# EAGLE design miniE_arduino_shield_v1-3 (EAGLE 6.1)
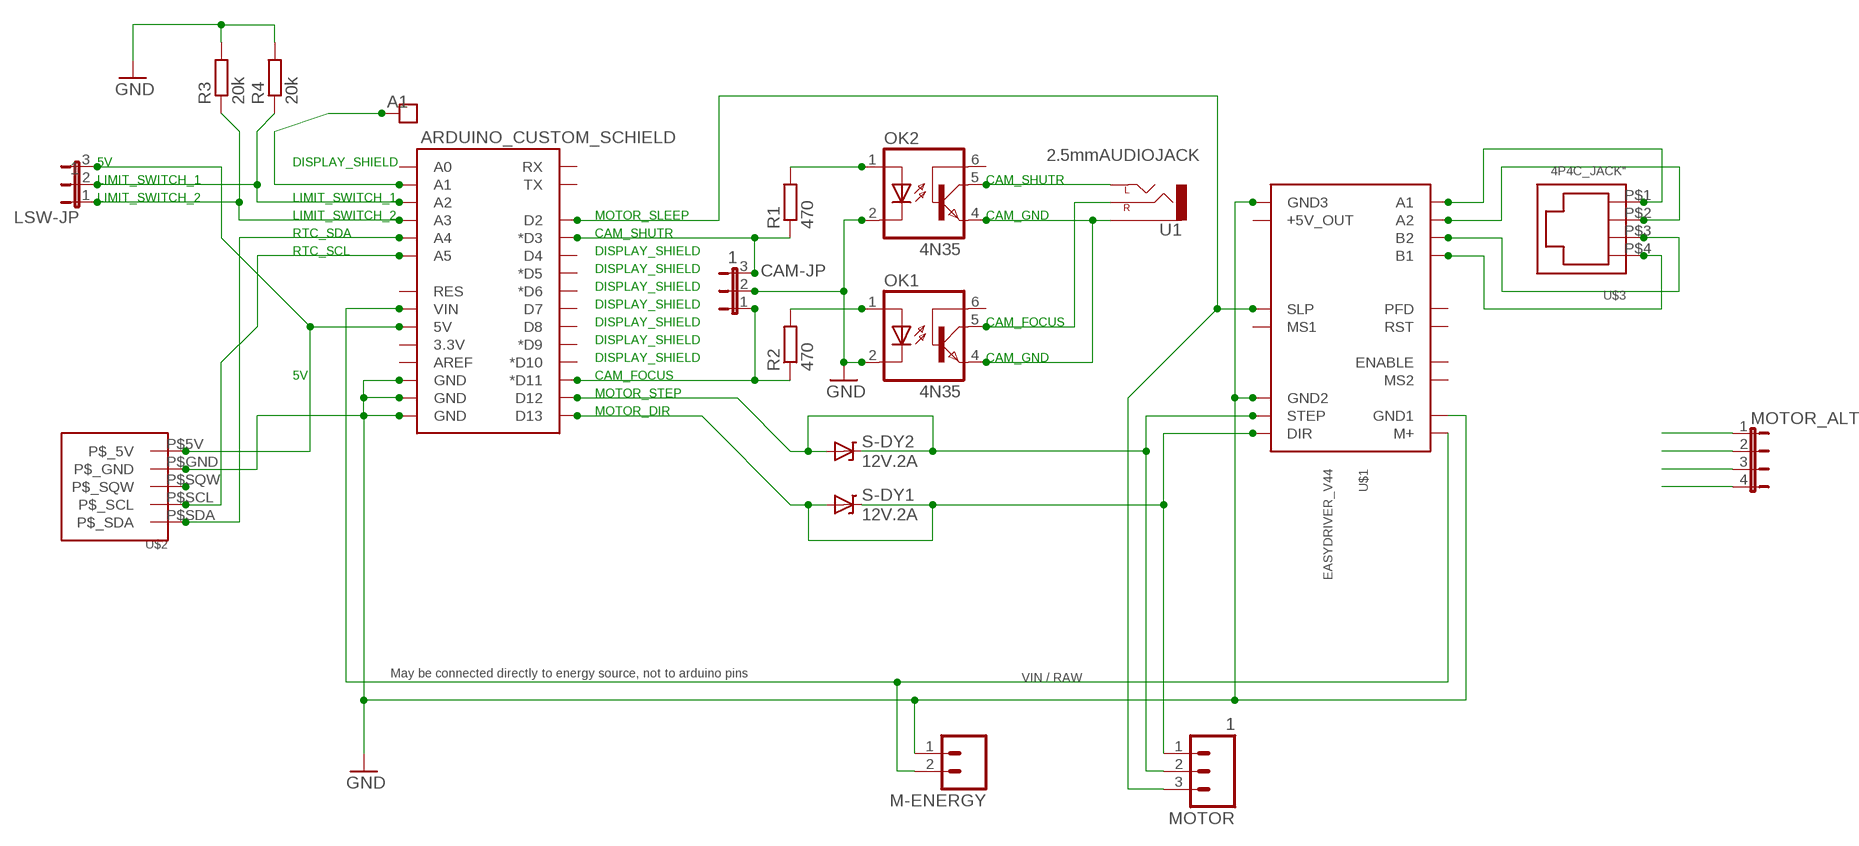
[diagram p0: schematic, sheet 1]

## Parts
ARDUINO_CUSTOM_SCHIELD  ARDUINO_SHIELDNOLABELS  [DUEMILANOVE_SHIELD_NOLABELS]
CAM-JP  1  JP2E  [JP2]
LSW-JP  1  JP2E  [JP2]
M-ENERGY  MOLEX_02  M02PTH  [1X02]
MOTOR  1  M03PTH  [1X03]
MOTOR_ALT  JP4E  [JP4]
OK1  4N35  [DIL06]
OK2  4N35  [DIL06]
R1  470  R-EU_0207/10  [0207/10]
R2  470  R-EU_0207/10  [0207/10]
R3  20k  R-EU_0207/10  [0207/10]
R4  20k  R-EU_0207/10  [0207/10]
S-DY1  12V.2A  DIODE-ZENERPTH  [DIODE-ZENER]
S-DY2  12V.2A  DIODE-ZENERPTH  [DIODE-ZENER]
U1  2.5mmAUDIOJACK  AUDIO-JACK2.5MM  [STEREOJACK2.5MM_STEREOJACK2.5MM]
U$1  EASYDRIVER_V44  [EASYDRIVER_V44]
U$2  SPARKFUN_RTC_MODULE-OPTIONAL  [SPARKFUN_RTC_MODULE_OPTIONAL]
U$3  4P4C_JACK"  [4P4C_JACK-ASS-2004-3-4-LP-N-R]
U$4  JUMPER_1X1  [JUMPER_1X1]

## Nets
+5V: ARDUINO_CUSTOM_SCHIELD.5V LSW-JP.3 U$2.P$5V(P$_5V)
A1: MOTOR_ALT.1 U$1.A1 U$3.P$1
A2: MOTOR_ALT.2 U$1.A2 U$3.P$2
B1: MOTOR_ALT.4 U$1.B1 U$3.P$4
B2: MOTOR_ALT.3 U$1.B2 U$3.P$3
CAM_FOCUS: OK1.5(COL) U1.RING1(RIGHT) U1.RING2(RIGHT)
CAM_GND: OK1.4(EMI) OK2.4(EMI) U1.SLEEVE
CAM_SHUTTER: OK2.5(COL) U1.TIP(LEFT)
GND: ARDUINO_CUSTOM_SCHIELD.GND@0(GND) ARDUINO_CUSTOM_SCHIELD.GND@1(GND) ARDUINO_CUSTOM_SCHIELD.GND@2(GND) CAM-JP.2 M-ENERGY.1 OK1.2(C) OK2.2(C) R3.2 R4.2 U$1.GND1 U$1.GND2 U$1.GND3 U$2.P$GND(P$_GND)
N$1: ARDUINO_CUSTOM_SCHIELD.D12 MOTOR.2 S-DY2.P$1(C) S-DY2.P$2(A) U$1.STEP
N$2: ARDUINO_CUSTOM_SCHIELD.D11(*D11) CAM-JP.1 R2.1
N$3: ARDUINO_CUSTOM_SCHIELD.D3(*D3) CAM-JP.3 R1.1
N$4: U$2.P$SQW(P$_SQW)
N$8: ARDUINO_CUSTOM_SCHIELD.D13 MOTOR.1 S-DY1.P$1(C) S-DY1.P$2(A) U$1.DIR
N$10: ARDUINO_CUSTOM_SCHIELD.D2 MOTOR.3 U$1.SLEEP(SLP)
N$11: OK2.1(A) R1.2
N$13: OK1.1(A) R2.2
N$16: ARDUINO_CUSTOM_SCHIELD.A2 LSW-JP.2 R4.1
N$17: ARDUINO_CUSTOM_SCHIELD.A3 LSW-JP.1 R3.1
N$18: ARDUINO_CUSTOM_SCHIELD.A4 U$2.P$SDA(P$_SDA)
N$19: ARDUINO_CUSTOM_SCHIELD.A5 U$2.P$SCL(P$_SCL)
N$24: ARDUINO_CUSTOM_SCHIELD.A1 U$4.P$1
VIN: ARDUINO_CUSTOM_SCHIELD.VIN M-ENERGY.2 U$1.M+
Unconnected: ARDUINO_CUSTOM_SCHIELD.3.3V ARDUINO_CUSTOM_SCHIELD.A0 ARDUINO_CUSTOM_SCHIELD.AREF ARDUINO_CUSTOM_SCHIELD.D4 ARDUINO_CUSTOM_SCHIELD.D5(*D5) ARDUINO_CUSTOM_SCHIELD.D6(*D6) ARDUINO_CUSTOM_SCHIELD.D7 ARDUINO_CUSTOM_SCHIELD.D8 ARDUINO_CUSTOM_SCHIELD.D9(*D9) ARDUINO_CUSTOM_SCHIELD.D10(*D10) ARDUINO_CUSTOM_SCHIELD.RES ARDUINO_CUSTOM_SCHIELD.RX ARDUINO_CUSTOM_SCHIELD.TX OK1.6(BAS) OK2.6(BAS) U$1.ENABLE U$1.MS1 U$1.MS2 U$1.P$11(+5V_OUT) U$1.PFD U$1.RST

## Notes on the sheet
- A1
- 5V | DISPLAY_SHIELD
- LIMIT_SWITCH_1 | CAM_SHUTR
- LIMIT_SWITCH_2 | LIMIT_SWITCH_1
- LIMIT_SWITCH_2 | MOTOR_SLEEP | CAM_GND
- RTC_SDA | CAM_SHUTR
- RTC_SCL | DISPLAY_SHIELD
- DISPLAY_SHIELD
- DISPLAY_SHIELD
- DISPLAY_SHIELD
- DISPLAY_SHIELD | CAM_FOCUS
- DISPLAY_SHIELD
- DISPLAY_SHIELD | CAM_GND
- 5V | CAM_FOCUS
- MOTOR_STEP
- MOTOR_DIR
- May be connected directly to energy source, not to arduino pins
- VIN / RAW

## Library data of the parts
ARDUINO_CUSTOM_SCHIELD = SparkFun:ARDUINO_SHIELD
CAM-JP LSW-JP = jumper:JP2E: JUMPER
M-ENERGY = SparkFun:M02: Header 2 Standard 2-pin 0.1" header. Use with straight break away headers (SKU : PRT-00116), right angle break away headers (PRT-00553), swiss pins (PRT-00743), machine pins (PRT-00117), and female headers (PRT-00115). Molex polarized connector foot print use with SKU : PRT-08233 with associated crimp pins and housings.
MOTOR = SparkFun:M03: Header 3 Standard 3-pin 0.1" header. Use with straight break away headers (SKU : PRT-00116), right angle break away headers (PRT-00553), swiss pins (PRT-00743), machine pins (PRT-00117), and female headers (PRT-00115). Molex polarized connector foot print use with SKU : PRT-08232 with associated crimp pins and housings.
MOTOR_ALT = jumper:JP4E: JUMPER
OK1 OK2 = optocoupler:4N35: MOTOROLA OPTO COUPLER; MF: FAIRCHILD SEMICONDUCTOR; MPN: 4N35; OC_FARNELL: 1328375; OC_NEWARK: 72K9946
R1-R4 = resistor:R-EU_: RESISTOR, European symbol
S-DY1 S-DY2 = SparkFun:DIODE-ZENER: Zener Diode Production Part - 8199 3.4V Zener Voltage
U1 = SparkFun:AUDIO-JACK: 3.5mm Audio Jack Simple 3.5mm common PCB mount audio jack. SKU: PRT-08032
U$1 = EasyDriver:EASYDRIVER_V44: EasyDriver version 4.4 - http://www.schmalzhaus.com/EasyDriver
U$2 = Personal:SPARKFUN_RTC_MODULE
U$3 = Airic Lenz:4P4C_JACK
U$4 = Airic Lenz:JUMPER_1X1

## Board
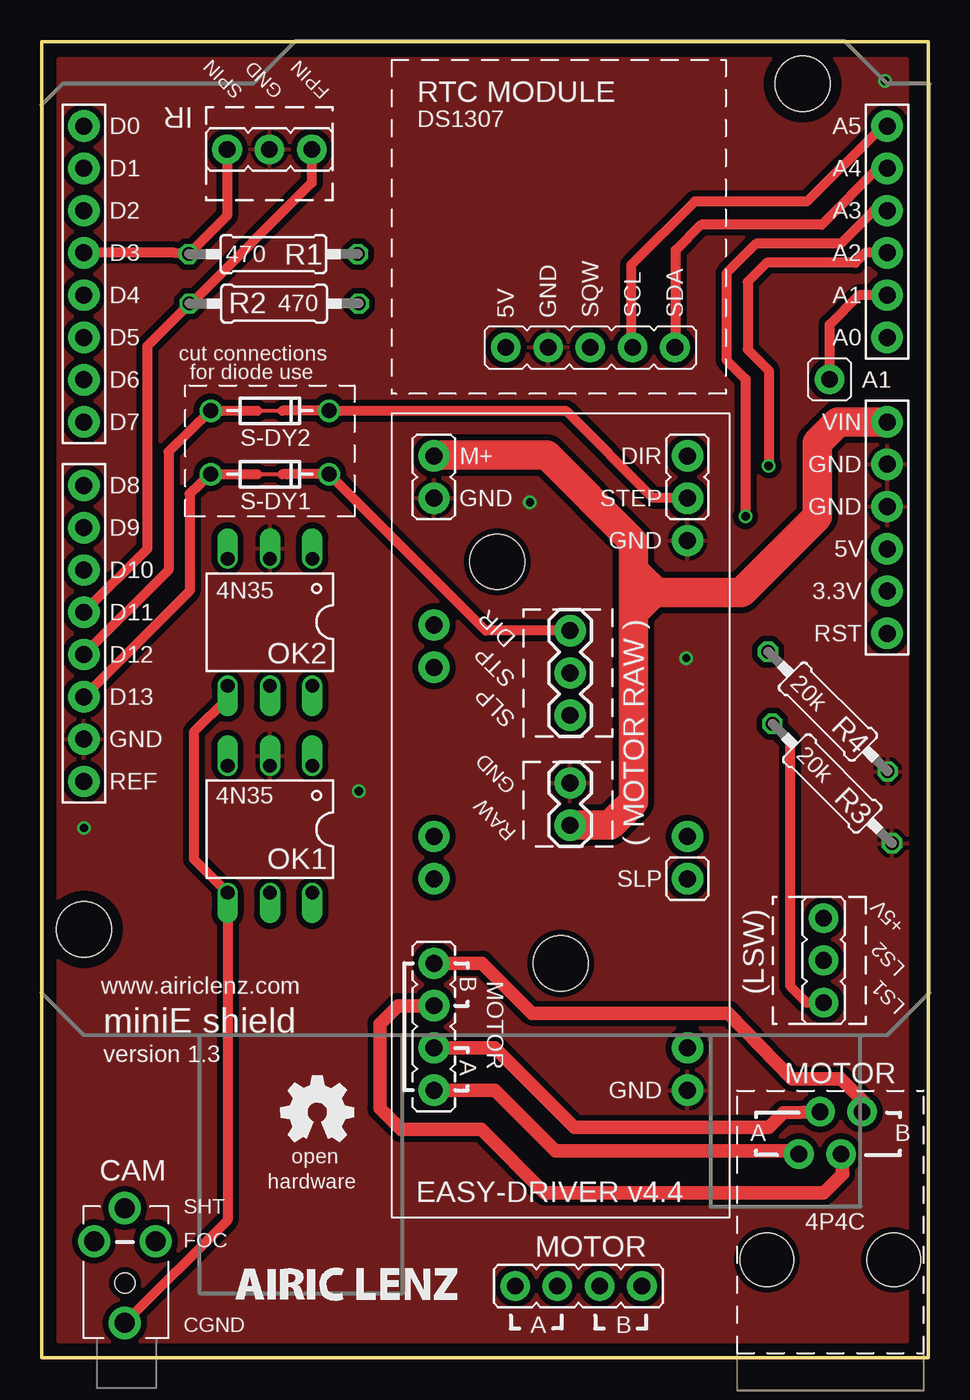
[diagram p1: board, top side]
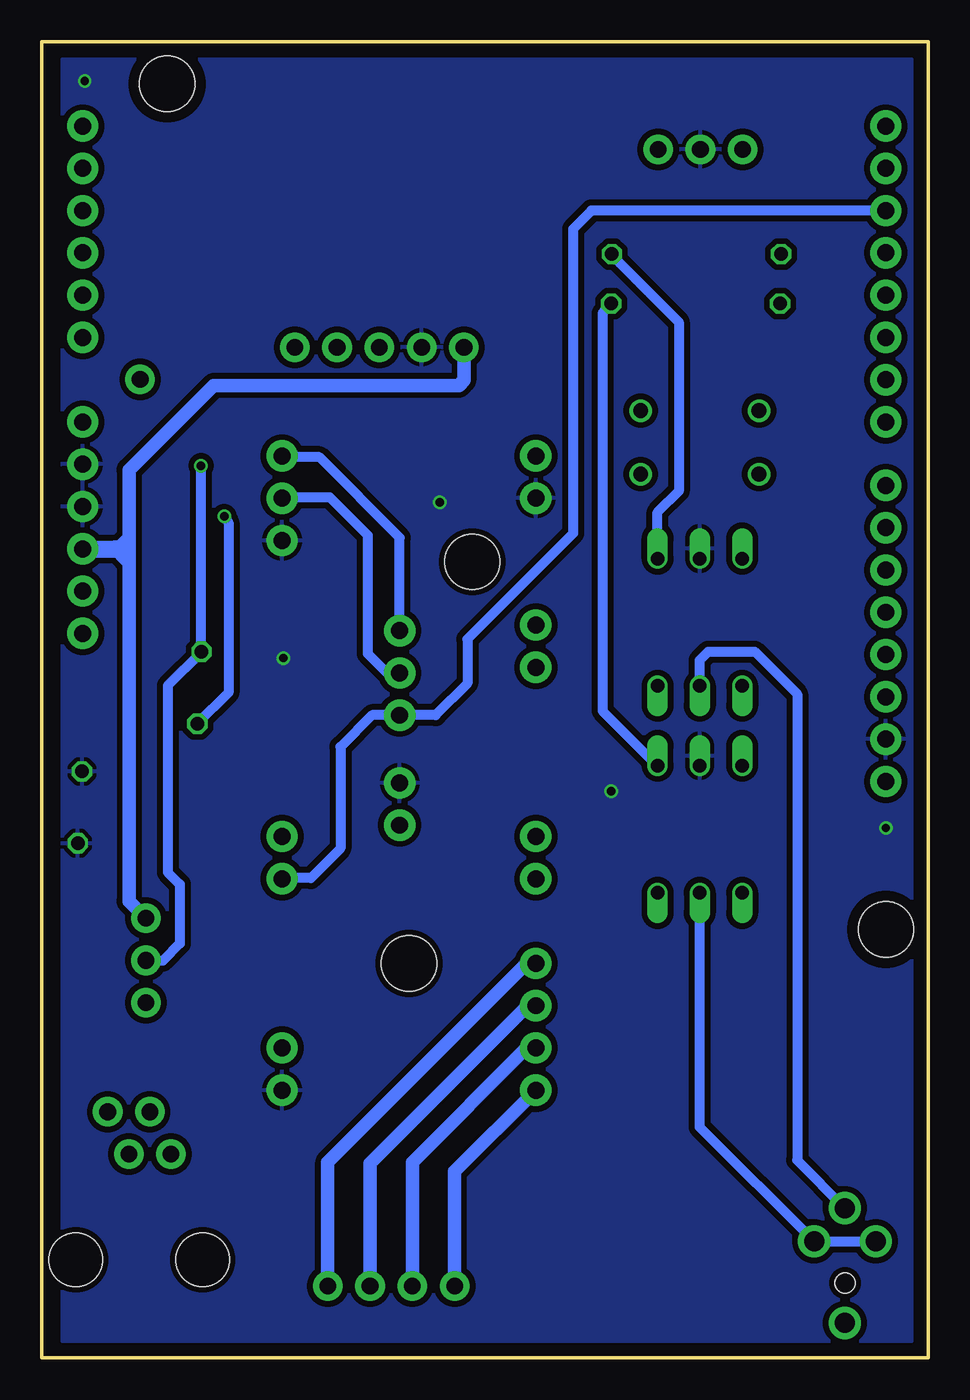
[diagram p2: board, bottom side, seen from below]

Size 53.26 x 79.07 mm. Coordinates in mm from the lower left corner, seen from the top.
Outline: 0,0 53.26,0 53.26,79.07 0,79.07 0,0
Copper layers (1*2*15*16): Top 0.035mm / dielectric 0.2mm / layer 2 0.0175mm / dielectric 1.1mm / layer 15 0.0175mm / dielectric 0.2mm / Bottom 0.035mm
Design rules "SeeedStudio_DRU_no_angle_20130527": minimum track width 6mil, minimum drill 12mil, track to track 6mil, track to pad 6mil, pad to pad 6mil, via to via 6mil, smd to smd 0mil, copper to edge 10mil, drill to drill 10mil, minimum pad ring 6mil, minimum via ring 6mil, stop-mask expansion 2mil, vias tented up to drill 25mil, thermal gap 10mil

### Footprints (pad centres in the part's own frame; a part is rotated, then mirrored left to right if it is on the bottom)
DUEMILANOVE_SHIELD_NOLABELS = drill 1.016 pad 1.88: 3.3V 50.8,26.67; 5V 50.8,29.21; A0 50.8,41.91; A1 50.8,44.45; A2 50.8,46.99; A3 50.8,49.53; A4 50.8,52.07; A5 50.8,54.61; AREF 2.54,15.24; D2 2.54,49.53; D3 2.54,46.99; D4 2.54,44.45; D5 2.54,41.91; D6 2.54,39.37; D7 2.54,36.83; D8 2.54,33.02; D9 2.54,30.48; D10 2.54,27.94; D11 2.54,25.4; D12 2.54,22.86; D13 2.54,20.32; GND@0 50.8,31.75; GND@1 50.8,34.29; GND@2 2.54,17.78; RES 50.8,24.13; RX 2.54,54.61; TX 2.54,52.07; VIN 50.8,36.83 | hole 3.302: 45.72,57.15; 2.54,6.35
JP2 = drill 1 pad 1.778: 1 -2.54,0; 2 0,0; 3 2.54,0
1X02 = drill 1.016 pad 1.88: 1 0,0; 2 2.54,0
1X03 = drill 1.016 pad 1.88: 1 0,0; 2 2.54,0; 3 5.08,0
JP4 = drill 1 pad 1.778: 1 -3.81,0; 2 -1.27,0; 3 1.27,0; 4 3.81,0
DIL06 = drill 0.813 offset: 1 -2.54,-3.81; 2 0,-3.81; 3 2.54,-3.81; 4 2.54,3.81; 5 0,3.81; 6 -2.54,3.81
0207/10 = drill 0.813 octagon: 1 -5.08,0; 2 5.08,0
DIODE-ZENER = drill 0.9: P$1 -3.556,0; P$2 3.556,0
STEREOJACK2.5MM_STEREOJACK2.5MM = drill 1.2 pad 1.93: RING1 2.5,1.85; RING2 2.5,-1.85; SLEEVE -2.4,0; TIP 4.5,0 | hole 1.2: 0,0
EASYDRIVER_V44 = drill 1.016 pad 1.88: A1 -16.51,7.62; A2 -13.97,7.62; B1 -8.89,7.62; B2 -11.43,7.62; DIR 21.59,-7.62; ENABLE 8.89,7.62; GND1 19.05,7.62; GND2 16.51,-7.62; GND3 -16.51,-7.62; M+ 21.59,7.62; MS1 -1.27,-7.62; MS2 11.43,7.62; P$11 -13.97,-7.62; PFD -3.81,7.62; RST -1.27,7.62; SLEEP -3.81,-7.62; STEP 19.05,-7.62 | hole 3.302: 15.24,3.81; -8.89,0
SPARKFUN_RTC_MODULE_OPTIONAL = drill 1 pad 1.778: P$5V -3.302,-8.128; P$GND -0.762,-8.128; P$SCL 4.318,-8.128; P$SDA 6.858,-8.128; P$SQW 1.778,-8.128
4P4C_JACK-ASS-2004-3-4-LP-N-R = drill 1 pad 1.778: P$1 -1.9,6.35; P$2 -0.63,8.89; P$3 0.63,6.35; P$4 1.9,8.89 | hole 3.2: -3.81,0; 3.81,0
JUMPER_1X1 = drill 1 pad 1.778: P$1 0,0

### Placement (x,y rotation side)
ARDUINO_CUSTOM_SCHIELD  0,19.39 0 top
CAM-JP  13.69,72.59 180 top
LSW-JP  46.99,23.88 90 top
M-ENERGY  31.75,34.54 270 top
MOTOR  31.75,43.69 270 top
MOTOR_ALT  32.26,4.32 0 top
OK1  13.72,31.75 180 top
OK2  13.72,44.2 180 top
R1  13.92,66.31 0 top
R2  13.97,63.33 0 top
R3  47.5,34.5 315 top
R4  47.24,38.82 315 top
S-DY1  13.72,53.09 180 top
S-DY2  13.72,56.9 180 top
U1  5,4.5 90 top
U$1  31.19,32.59 90 top
U$2  31.19,68.83 0 top
U$3  47.4,5.89 0 top
U$4  47.35,58.78 0 top

### Tracks (layer width: path | path; a pad name or v marks a point on that pad's centre or on a via)
+5V
  Bottom 0.813: 48.85,48.6 48.77,48.51 | 48.77,48.51 48.26,48.01 | 48.26,48.01 48.01,47.75 | 48.01,47.75 48.01,27.43 LSW-JP.3 | U$2.P$5V 27.89,58.73 28.19,58.42 42.93,58.42 48.01,53.34 48.01,49.28 | 48.01,49.28 48.01,48.26 | 48.01,48.26 48.26,48.01 | 48.77,48.51 48.01,49.28 | 48.01,48.26 48.01,47.75
  Bottom 1.016: ARDUINO_CUSTOM_SCHIELD.5V 48.85,48.6
A1
  Top 0.813: U$1.A1 27.23,16.08 30.86,12.45 45.34,12.45 45.59,12.19 U$3.P$1
  Bottom 0.813: MOTOR_ALT.1 28.45,11.2 U$1.A1
A2
  Top 0.813: U$1.A2 27.23,18.62 32,13.84 43.69,13.84 44.58,14.73 U$3.P$2
  Bottom 0.813: MOTOR_ALT.2 30.99,11.76 24.13,18.62 U$1.A2
B1
  Top 0.813: U$1.B1 26.47,23.7 29.46,20.7 41.27,20.7 45.09,16.76 48.01,16.76 49.4,15.37 49.4,14.73 U$3.P$4
  Bottom 0.813: MOTOR_ALT.4 36.07,11.76 24.13,23.7 U$1.B1
B2
  Top 0.813: U$1.B2 21.41,21.16 20.32,20.07 20.32,14.99 21.59,13.72 26.42,13.72 30.23,9.91 46.99,9.91 48.13,11.05 U$3.P$3
  Bottom 0.813: MOTOR_ALT.3 33.53,11.68 24.13,21.08 23.65,21.08 U$1.B2
CAM_FOCUS
  Bottom 0.61: OK1.5 13.72,13.86 U1.RING2 U1.RING1
CAM_GND
  Top 0.61: OK2.4 11.18,39.62 9.14,37.59 9.14,29.97 OK1.4 11.18,8.27 U1.SLEEVE
CAM_SHUTTER
  Bottom 0.61: OK2.5 13.72,41.91 13.21,42.42 10.41,42.42 7.87,39.88 7.87,11.87 U1.TIP
GND  (via drill 0.5)
  other vias: 2.54,31.84 50.67,76.71 29.34,51.39 38.73,42.04 19.05,34.04
  pour Top (isolate 0.35): 1,1 52,1 52,78 1,78 1,77
  pour Bottom (isolate 0.35): 1,1 52,1 52,78 1,78
N$1
  Top 0.254: 12.95,56.9 14.48,56.9
  Top 0.61: 2.63,42.16 ARDUINO_CUSTOM_SCHIELD.D12 7.62,47.33 7.62,54.44 S-DY2.P$2 12.95,56.9 | U$1.STEP 38.76,51.69 36.7,51.69 31.5,56.9 S-DY2.P$1 14.48,56.9
  Bottom 0.61: MOTOR.2 32.51,41.15 33.66,42.29 33.66,49.4 35.94,51.69 38.76,51.69 U$1.STEP
N$2
  Top 0.61: 2.58,44.83 ARDUINO_CUSTOM_SCHIELD.D11 6.35,48.6 6.35,60.79 R2.1 8.98,63.33 16.23,70.58 CAM-JP.1
N$3
  Top 0.61: ARDUINO_CUSTOM_SCHIELD.D3 8,66.38 R1.1 11.15,68.61 CAM-JP.3
N$8
  Top 0.254: 12.95,53.09 14.73,53.09
  Top 0.61: MOTOR.1 28.96,43.69 26.67,43.69 S-DY1.P$1 14.73,53.09 14.48,53.09 | ARDUINO_CUSTOM_SCHIELD.D13 8.89,46.06 8.89,51.9 S-DY1.P$2 12.95,53.09
  Bottom 0.61: U$1.DIR 38.73,54.1 36.58,54.1 31.75,49.28 MOTOR.1
N$10
  Bottom 0.61: U$1.SLEEP 38.76,28.83 37.08,28.83 35.31,30.61 35.31,36.7 33.4,38.6 MOTOR.3 29.59,38.61 27.69,40.51 27.69,43.18 21.34,49.53 21.34,67.82 20.23,68.92 ARDUINO_CUSTOM_SCHIELD.D2
N$11
  Bottom 0.61: R1.2 19.06,66.31 14.99,62.23 14.99,52.07 16.26,50.8 OK2.1
N$13
  Bottom 0.61: OK1.1 19.56,38.86 19.56,62.74 R2.2
N$16  (via drill 0.5)
  Top 0.61: ARDUINO_CUSTOM_SCHIELD.A2 49.49,66.38 48.9,65.79 43.56,65.79 42.42,64.64 42.42,60.58 43.69,59.31 v43.69,53.59
  Bottom 0.61: v43.69,53.59 43.69,42.38 R4.1 45.68,40.38 45.68,29.17 44.96,28.45 44.96,24.89 45.97,23.88 LSW-JP.2
N$17  (via drill 0.5)
  Top 0.61: ARDUINO_CUSTOM_SCHIELD.A3 50,68.92 48.01,66.93 42.93,66.93 41.15,65.15 41.15,59.94 42.29,58.8 v42.29,50.55 | R3.1 44.96,37.04 44.96,22.35 45.97,21.34 LSW-JP.1
  Bottom 0.61: v42.29,50.55 42.04,50.16 42.04,39.96 R3.1
N$18
  Top 0.61: ARDUINO_CUSTOM_SCHIELD.A4 50.25,71.46 46.86,68.07 39.62,68.07 38.1,66.55 38.1,60.76 U$2.P$SDA
N$19
  Top 0.61: ARDUINO_CUSTOM_SCHIELD.A5 50.33,73.79 45.97,69.47 39.24,69.47 35.43,65.66 35.43,60.76 35.45,60.76 U$2.P$SCL
N$24
  Top 0.61: ARDUINO_CUSTOM_SCHIELD.A1 49.11,63.84 47.35,62.08 U$4.P$1
VIN
  Top 1.016: 35.69,47.75 37.47,45.97 | 37.34,45.97 35.56,44.2
  Top 1.422: M-ENERGY.2
  Top 1.778: ARDUINO_CUSTOM_SCHIELD.VIN 47.84,56.22 46.61,54.99 46.61,50.55 42.04,45.97 37.47,45.97 37.34,45.97 35.56,45.97 | 35.56,45.97 35.56,49.02 30.35,54.23 23.62,54.23 U$1.M+ | 35.56,45.97 35.56,44.2 35.56,33.4 34.16,32 M-ENERGY.2

### Text on the board
tPlace: SPIN | GND | FPIN | IR | A5 | D0 | A4 | D1 | A3 | D2 | A2 | D3 | A1 | D4 | A0 | D5 | cut connections | for diode use | D6 | A1 | VIN | D7 | GND | D8 | GND | D9 | 5V | D10 | 3.3V | D11 | RST | DIR | D12 | STP | D13 | SLP | GND | REF | GND | RAW | ( MOTOR RAW ) | +5V | LS2 | (LSW) | LS1 | MOTOR | CAM | EASY-DRIVER v4.4 | MOTOR
tNames: www.airiclenz.com | miniE shield | version 1.3 | A | B | open | hardware | SHT | 4P4C | FOC | CGND | A | B
bStop: miniE shield | version 1.3 | 2012 by Airic Lenz